# Altium project LED_PCB.PrjPcb
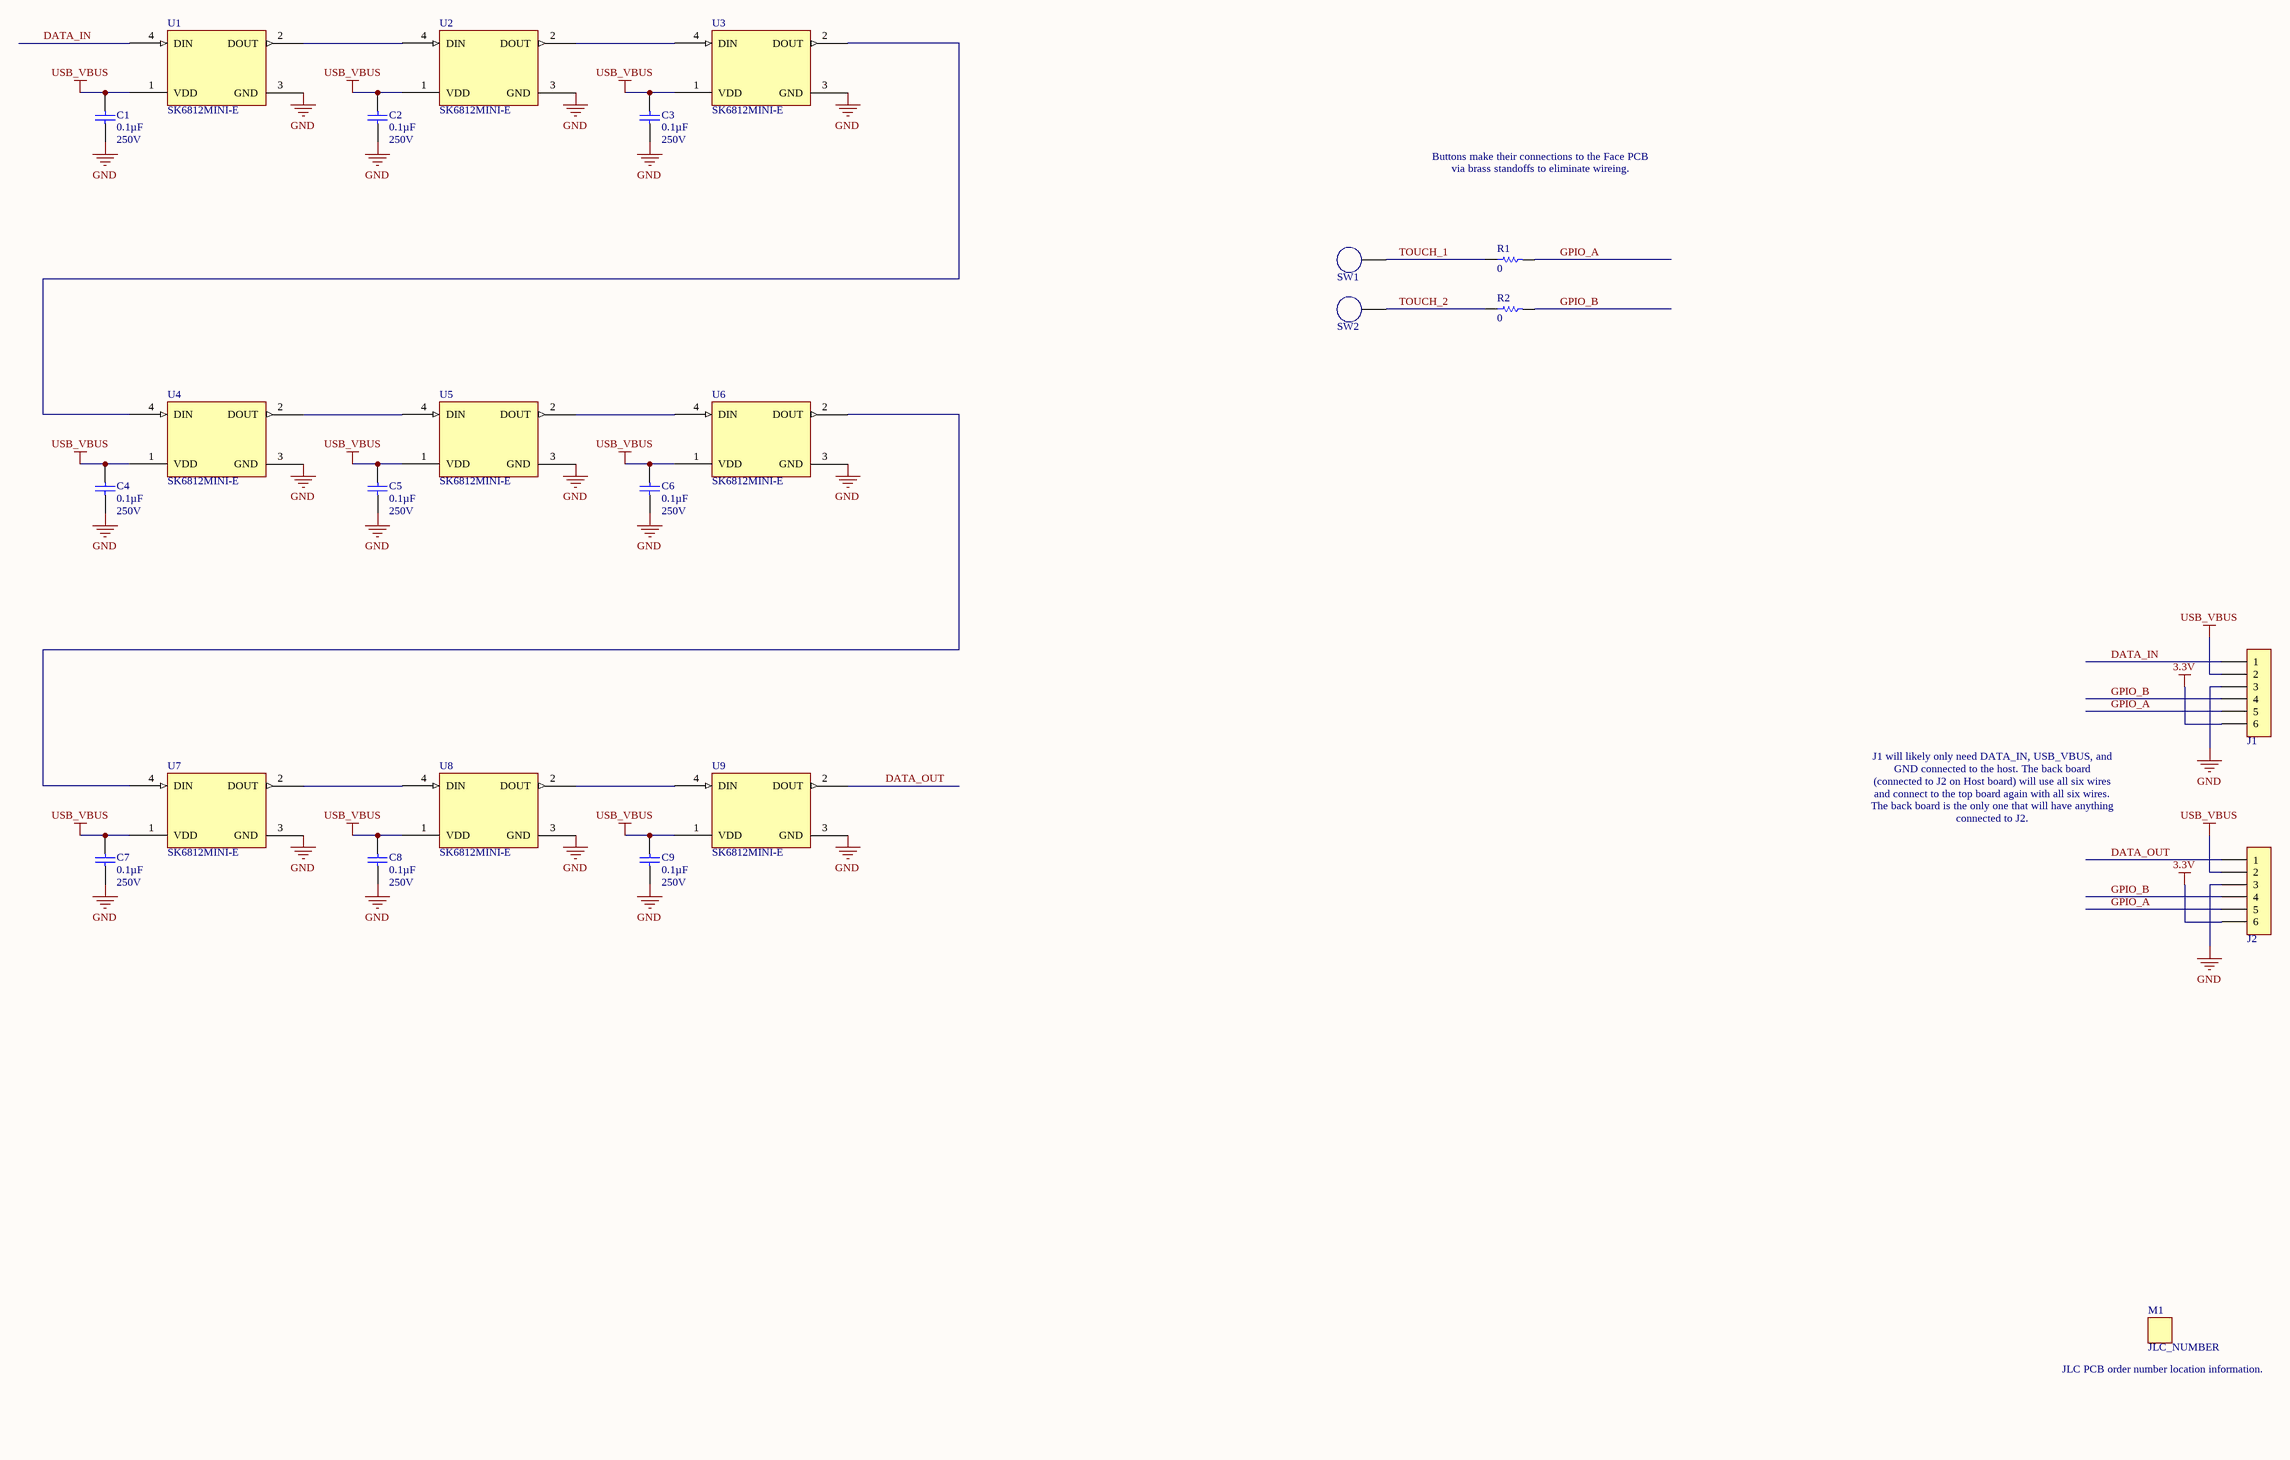
[diagram p0: LED_PCB.SchDoc]
LeadEngineer: JCF; HardRev: B; Codename: LED_CUBE-LED_BOARD; BOMRev: B
1 sheet, 25 parts. Net scope: global (net labels, ports and power ports of the same name join across sheets).
Board file: LED_PCB.PcbDoc

## Sheet LED_PCB.SchDoc: TITLE GOES HERE
size C; Author: EBK; CompanyName: Vaddio; Organization: Vaddio; Address1: 131 Cheshire Lane; Address2: Minnetonka, MN  55305; Address3: www.vaddio.com; Address4: 800-572-2011; SheetNumber: 1; SheetTotal: 1

### Parts
C1  0.1µF  Voltage: 250V  [Chip0805]
C2  0.1µF  Voltage: 250V  [Chip0805]
C3  0.1µF  Voltage: 250V  [Chip0805]
C4  0.1µF  Voltage: 250V  [Chip0805]
C5  0.1µF  Voltage: 250V  [Chip0805]
C6  0.1µF  Voltage: 250V  [Chip0805]
C7  0.1µF  Voltage: 250V  [Chip0805]
C8  0.1µF  Voltage: 250V  [Chip0805]
C9  0.1µF  Voltage: 250V  [Chip0805]
J1  HEADER_1x6_NO_BOM  [HEADER_1x6_100mil_NP]  (value not drawn)  (no BOM)
J2  HEADER_1x6_NO_BOM  [HEADER_1x6_100mil_NP]  (value not drawn)  (no BOM)
M1  JLC_NUMBER  [JLC_NUMBER]  (no BOM)
R1  0  [Chip0805]
R2  0  [Chip0805]
SW1  TOUCH_PAD_NO_BOM  [TENTED_PAD_5mil]  (value not drawn)  (no BOM)
SW2  TOUCH_PAD_NO_BOM  [TENTED_PAD_5mil]  (value not drawn)  (no BOM)
U1  SK6812MINI-E  [SK6812MINI-E]
U2  SK6812MINI-E  [SK6812MINI-E]
U3  SK6812MINI-E  [SK6812MINI-E]
U4  SK6812MINI-E  [SK6812MINI-E]
U5  SK6812MINI-E  [SK6812MINI-E]
U6  SK6812MINI-E  [SK6812MINI-E]
U7  SK6812MINI-E  [SK6812MINI-E]
U8  SK6812MINI-E  [SK6812MINI-E]
U9  SK6812MINI-E  [SK6812MINI-E]

### Nets
3.3V: J1.6 J2.6
GND: C1.1 C2.1 C3.1 C4.1 C5.1 C6.1 C7.1 C8.1 C9.1 J1.3 J2.3 U1.3(GND) U2.3(GND) U3.3(GND) U4.3(GND) U5.3(GND) U6.3(GND) U7.3(GND) U8.3(GND) U9.3(GND)
USB_VBUS: C1.2 C2.2 C3.2 C4.2 C5.2 C6.2 C7.2 C8.2 C9.2 J1.2 J2.2 U1.1(VDD) U2.1(VDD) U3.1(VDD) U4.1(VDD) U5.1(VDD) U6.1(VDD) U7.1(VDD) U8.1(VDD) U9.1(VDD)
DATA_IN: J1.1 U1.4(DIN)
DATA_OUT: J2.1 U9.2(DOUT)
GPIO_A: J1.5 J2.5 R1.2
GPIO_B: J1.4 J2.4 R2.2
TOUCH_1: R1.1 SW1.1
TOUCH_2: R2.1 SW2.1
NetU1_2: U1.2(DOUT) U2.4(DIN)
NetU2_2: U2.2(DOUT) U3.4(DIN)
NetU3_2: U3.2(DOUT) U4.4(DIN)
NetU4_2: U4.2(DOUT) U5.4(DIN)
NetU5_2: U5.2(DOUT) U6.4(DIN)
NetU6_2: U6.2(DOUT) U7.4(DIN)
NetU7_2: U7.2(DOUT) U8.4(DIN)
NetU8_2: U8.2(DOUT) U9.4(DIN)

### Notes on the sheet
- Buttons make their connections to the Face PCB via brass standoffs to eliminate wireing.
- J1 will likely only need DATA_IN, USB_VBUS, and GND connected to the host. The back board (connected to J2 on Host board) will use all six wires and connect to the top board again with all six wires. The back board is the only one that will have anything connected to J2.
- (near M1) JLC PCB order number location information.
- Title:
- This work is licensed under a Creative Commons Attribution 4.0 International License. Derivative works should remove all Sophistry branding and ‘é’ watermark.
- Date:
- Engineer:
- Revision:
- Codename:
- Time:
- Variant:
- Sheet
- of

### Library data of the parts
C1-C9 = C2012X7T2E104K125AA: CAP CER 0.1UF 250V 10% X7T 0805; Manufacturer: TDK Corporation; PartNumber: C2012X7T2E104K125AA; HelpURL: http://product.tdk.com/capacitor/mlcc/en/documents/mlcc_commercial_midvoltage_en.pdf; Supplier 1: Digi-Key; Supplier Part Number 1: 445-7749-1-ND; Supplier 2: Mouser; Manufacturer Part Number: C2012X7T2E104K125AA; Series: C; Capacitance: 0.1µF; Tolerance: ±10%; Temperature Coefficient: X7T; Mounting Type: Surface Mount, MLCC; Operating Temperature: -55°C ~ 125°C; Applications: General Purpose; Ratings: -; Package / Case: 0805 (2012 Metric); Size / Dimension: 0.079" L x 0.049" W (2.00mm x 1.25mm); Height - Seated (Max): -; Thickness (Max): 0.057" (1.45mm); Lead Spacing: -; Features: -; Lead Style: -
M1 = JLC_NUMBER: JLC Order Number Location; PartNumber: JLC_NUMBER; Manufacturer Part Number: JLC_NUMBER
R1 R2 = CRCW08050000Z0EA: RES 0.0 OHM 1/8W JUMP 0805 SMD; Manufacturer: Vishay Dale; Tolerance: Jumper; Power (Watts): 0.125W, 1/8W; PartNumber: CRCW08050000Z0EA; HelpURL: http://www.vishay.com/doc?20035; Supplier 1: Digi-Key; Supplier Part Number 1: 541-0.0ACT-ND; Supplier 2: Mouser; Manufacturer Part Number: CRCW08050000Z0EA; Series: CRCW; Resistance: 0; Composition: Thick Film; Features: Automotive AEC-Q200 Qualified; Temperature Coefficient: -; Package / Case: 0805 (2012 Metric); Supplier Device Package: 0805 (2012 Metric); Size / Dimension: 0.079" L x 0.049" W (2.00mm x 1.25mm); Height: 0.020" (0.50mm); Number of Terminations: 2
U1-U9 = SK6812MINI-E: Addressable RGB LED; Manufacturer: Adafruit Industries LLC; PartNumber: SK6812MINI-E; Datasheets: https://cdn-shop.adafruit.com/product-files/4960/4960_SK6812MINI-E_REV02_EN.pdf; Supplier 1: Digi-Key; Supplier Part Number 1: 1528-4960-ND; Manufacturer Part Number: SK6812MINI-E
J1 J2 = HEADER_1x6_NO_BOM: PartNumber: HEADER_1x6_NO_BOM; Manufacturer Part Number: HEADER_1x6_NO_BOM
SW1 SW2 = TOUCH_PAD_NO_BOM: PartNumber: TOUCH_PAD_NO_BOM; Manufacturer Part Number: TOUCH_PAD_NO_BOM

## Assembly variants
Recommended Build: not fitted C10 R1 R2 R3 R4 R5 R6 R7 U10